# EAGLE design DigitalIO (EAGLE 7.7.0)
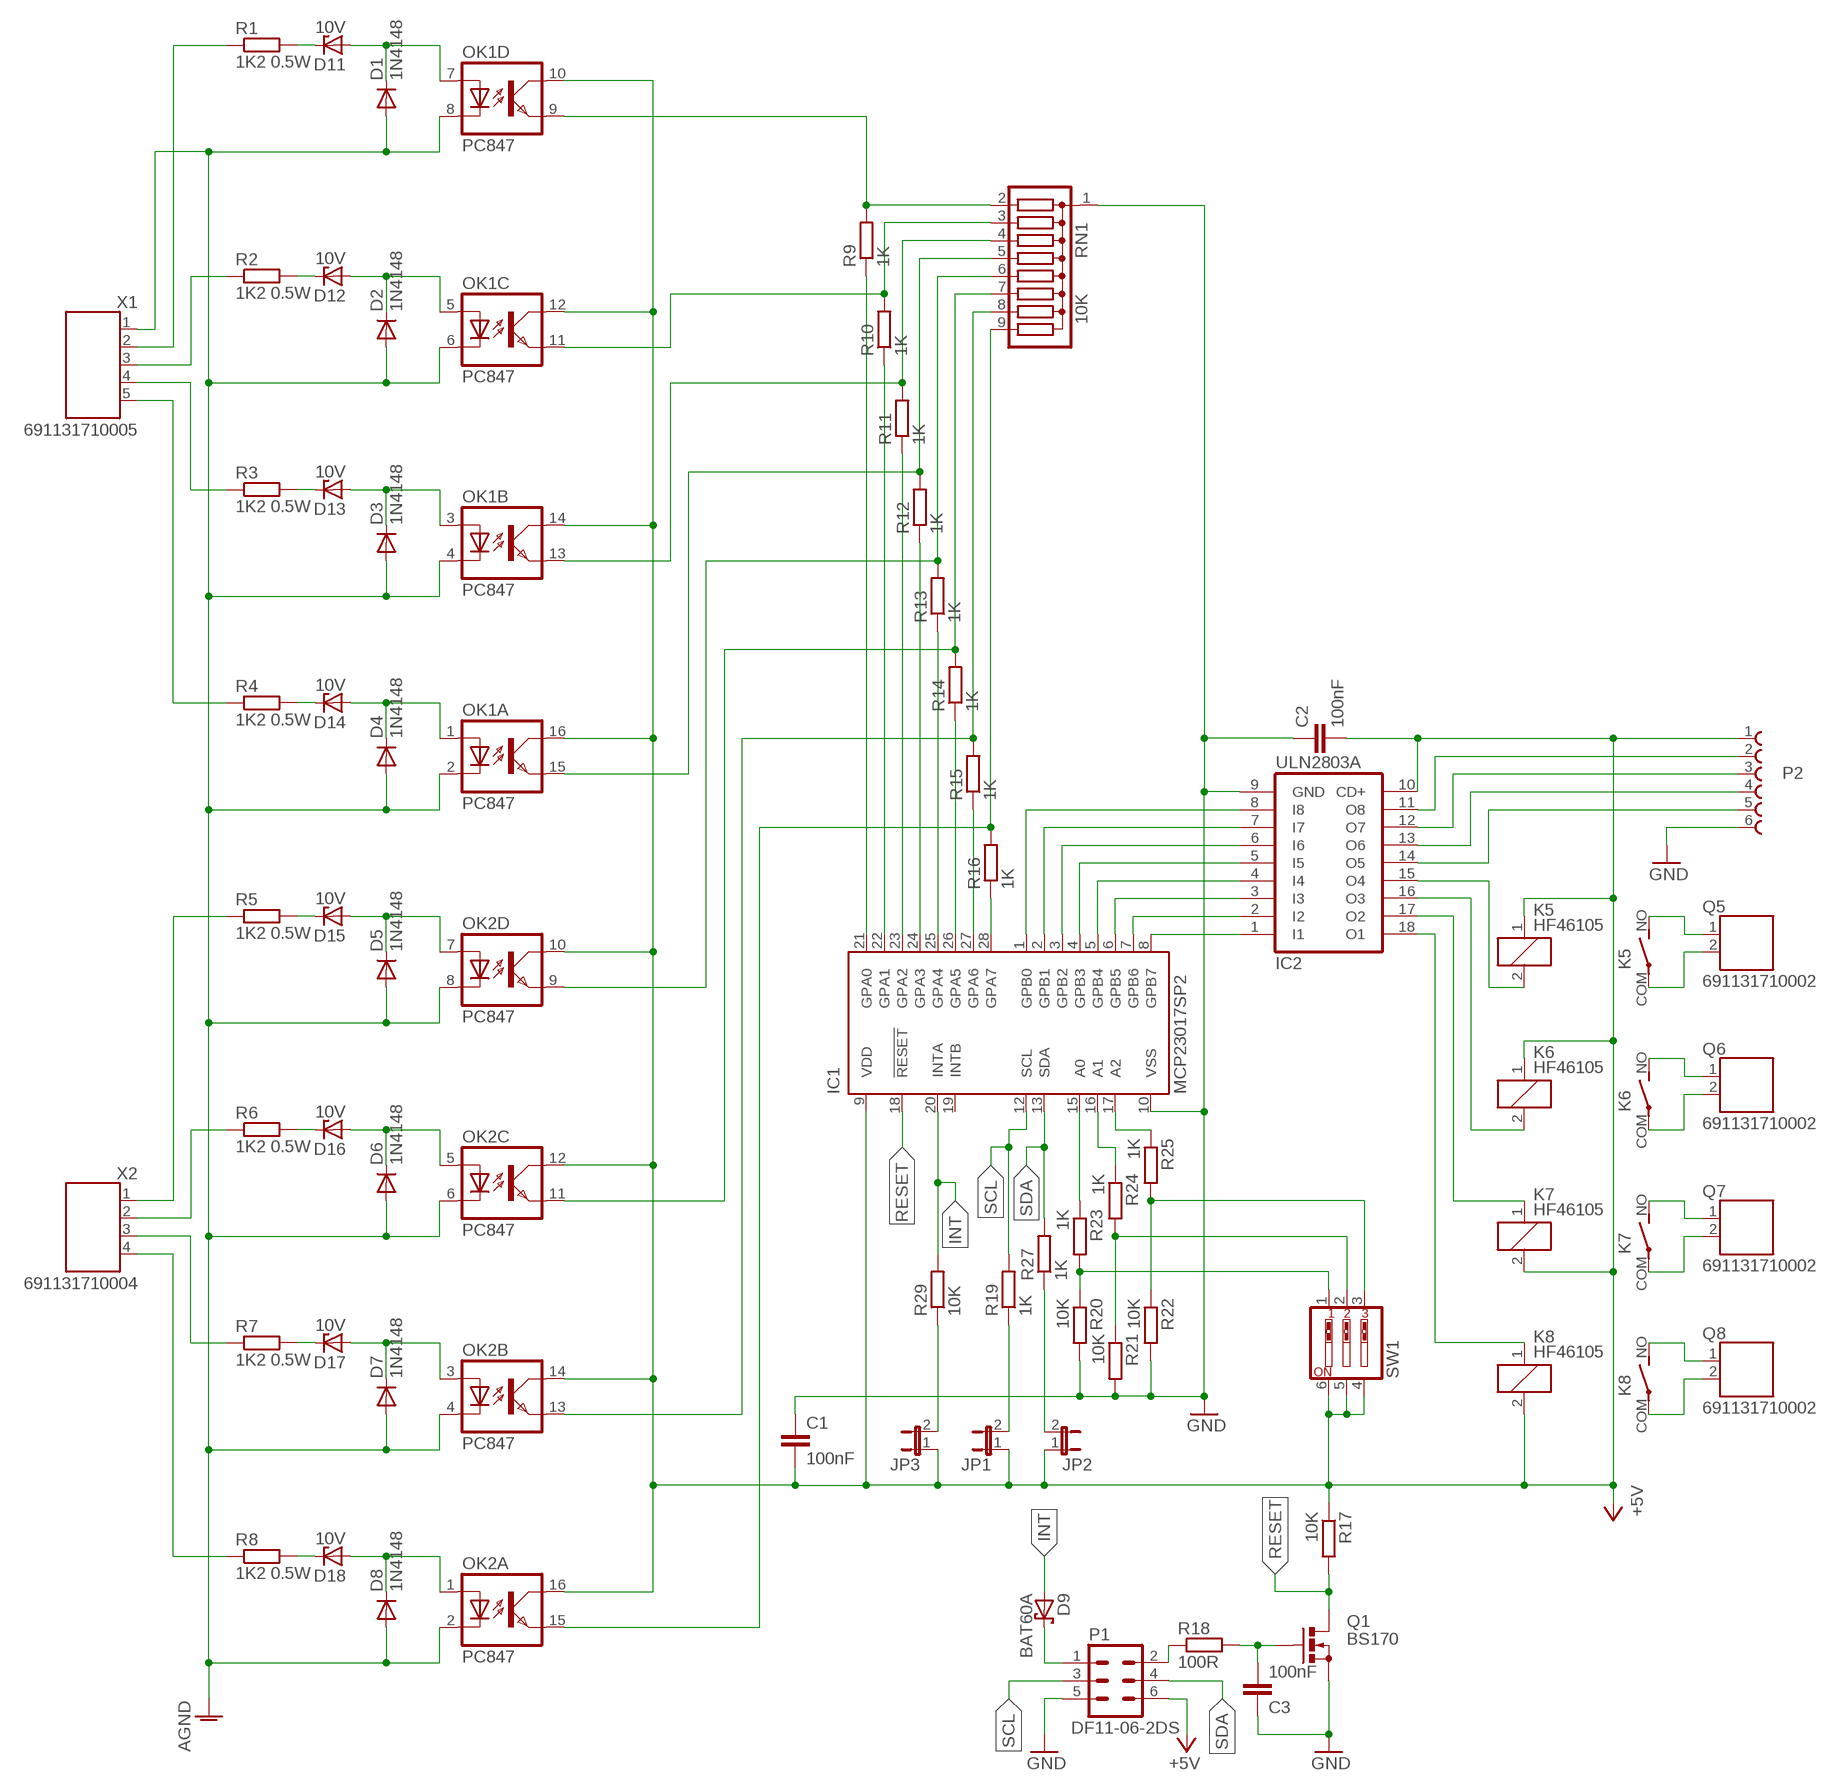
[diagram p0: schematic, sheet 1]

## Parts
C1  100nF  C-EUC0805  [C0805]
C2  100nF  C-EUC0805  [C0805]
C3  100nF  C-EUC0805  [C0805]
D1  1N4148  1N4148DO35-2V  [DO35-2V]
D2  1N4148  1N4148DO35-2V  [DO35-2V]
D3  1N4148  1N4148DO35-2V  [DO35-2V]
D4  1N4148  1N4148DO35-2V  [DO35-2V]
D5  1N4148  1N4148DO35-2V  [DO35-2V]
D6  1N4148  1N4148DO35-2V  [DO35-2V]
D7  1N4148  1N4148DO35-2V  [DO35-2V]
D8  1N4148  1N4148DO35-2V  [DO35-2V]
D9  BAT60A  BAT60J  [SOD323_ST]
D11  10V  ZENER-DIODEZD-2.5  [ZDIO-2.5]
D12  10V  ZENER-DIODEZD-2.5  [ZDIO-2.5]
D13  10V  ZENER-DIODEZD-2.5  [ZDIO-2.5]
D14  10V  ZENER-DIODEZD-2.5  [ZDIO-2.5]
D15  10V  ZENER-DIODEZD-2.5  [ZDIO-2.5]
D16  10V  ZENER-DIODEZD-2.5  [ZDIO-2.5]
D17  10V  ZENER-DIODEZD-2.5  [ZDIO-2.5]
D18  10V  ZENER-DIODEZD-2.5  [ZDIO-2.5]
IC1  MCP23017SP2  [DIL28-3-ROUND]
IC2  ULN2803A  ULN2803ASP2  [DIL18-ROUND]
JP1  JP1E  [JP1]
JP2  JP1E  [JP1]
JP3  JP1E  [JP1]
K5  HF46105  [HF46]
K6  HF46105  [HF46]
K7  HF46105  [HF46]
K8  HF46105  [HF46]
OK1  PC847  [DIL16]
OK2  PC847  [DIL16]
P1  DF11-06-2DS  [DF11-06DP-2DS]
P2  62000611121  [62000611121]
Q1  BS170  [SOT54E]
Q5  691131710002  [691131710002]
Q6  691131710002  [691131710002]
Q7  691131710002  [691131710002]
Q8  691131710002  [691131710002]
R1  1K2 0.5W  R-EU_0207/2V  [0207/2V]
R2  1K2 0.5W  R-EU_0207/2V  [0207/2V]
R3  1K2 0.5W  R-EU_0207/2V  [0207/2V]
R4  1K2 0.5W  R-EU_0207/2V  [0207/2V]
R5  1K2 0.5W  R-EU_0207/2V  [0207/2V]
R6  1K2 0.5W  R-EU_0207/2V  [0207/2V]
R7  1K2 0.5W  R-EU_0207/2V  [0207/2V]
R8  1K2 0.5W  R-EU_0207/2V  [0207/2V]
R9  1K  R-EU_0204/2V  [0204V]
R10  1K  R-EU_0204/2V  [0204V]
R11  1K  R-EU_0204/2V  [0204V]
R12  1K  R-EU_0204/2V  [0204V]
R13  1K  R-EU_0204/2V  [0204V]
R14  1K  R-EU_0204/2V  [0204V]
R15  1K  R-EU_0204/2V  [0204V]
R16  1K  R-EU_0204/2V  [0204V]
R17  10K  R-EU_0204/2V  [0204V]
R18  100R  R-EU_0204/2V  [0204V]
R19  1K  R-EU_0204/2V  [0204V]
R20  10K  R-EU_0204/2V  [0204V]
R21  10K  R-EU_0204/2V  [0204V]
R22  10K  R-EU_0204/2V  [0204V]
R23  1K  R-EU_0204/2V  [0204V]
R24  1K  R-EU_0204/2V  [0204V]
R25  1K  R-EU_0204/2V  [0204V]
R27  1K  R-EU_0204/2V  [0204V]
R29  10K  R-EU_0204/2V  [0204V]
RN1  10K  G08R  [SIL9]
SW1  SW_DIP-3  [EDG-03]
X1  691131710005  [691131710005]
X2  691131710004  [691131710004]

## Nets
+5V: C1.2 C2.2 IC1.9(VDD) IC2.10(CD+) JP1.1 JP2.1 JP3.1 K5.1 K6.1 K7.2 K8.2 OK1.10(D:COL) OK1.12(C:COL) OK1.14(B:COL) OK1.16(A:COL) OK2.10(D:COL) OK2.12(C:COL) OK2.14(B:COL) OK2.16(A:COL) P1.6 P2.1 R17.1 SW1.4 SW1.5 SW1.6
AGND: D1.A D2.A D3.A D4.A D5.A D6.A D7.A D8.A OK1.2(A:C) OK1.4(B:C) OK1.6(C:C) OK1.8(D:C) OK2.2(A:C) OK2.4(B:C) OK2.6(C:C) OK2.8(D:C) X1.1
GND: C1.1 C2.1 C3.1 IC1.10(VSS) IC2.9(GND) P1.5 P2.6 Q1.S R20.2 R21.2 R22.2 RN1.1
INT: D9.A IC1.20(INTA) R29.2
N$1: IC1.8(GPB7) IC2.1(I1)
N$2: IC1.7(GPB6) IC2.2(I2)
N$3: IC1.6(GPB5) IC2.3(I3)
N$4: IC1.5(GPB4) IC2.4(I4)
N$5: IC1.4(GPB3) IC2.5(I5)
N$6: IC1.3(GPB2) IC2.6(I6)
N$7: IC1.2(GPB1) IC2.7(I7)
N$8: IC1.1(GPB0) IC2.8(I8)
N$9: D12.C R2.2
N$10: D11.C R1.2
N$11: R22.1 R25.2 SW1.3
N$12: D1.C D11.A OK1.7(D:A)
N$13: R6.1 X2.2
N$14: R2.1 X1.3
N$15: OK1.9(D:EMIT) R9.2 RN1.2
N$16: R3.1 X1.4
N$17: R7.1 X2.3
N$18: R1.1 X1.2
N$19: D2.C D12.A OK1.5(C:A)
N$20: OK1.11(C:EMIT) R10.2 RN1.3
N$21: D13.C R3.2
N$22: R4.1 X1.5
N$23: D3.C D13.A OK1.3(B:A)
N$24: R5.1 X2.1
N$25: OK1.13(B:EMIT) R11.2 RN1.4
N$26: R8.1 X2.4
N$27: D14.C R4.2
N$28: IC2.14(O5) P2.5
N$29: D4.C D14.A OK1.1(A:A)
N$30: IC2.13(O6) P2.4
N$31: OK1.15(A:EMIT) R12.2 RN1.5
N$32: IC2.12(O7) P2.3
N$33: D15.C R5.2
N$34: IC2.11(O8) P2.2
N$35: D5.C D15.A OK2.7(D:A)
N$36: JP2.2 R27.1
N$37: OK2.9(D:EMIT) R13.2 RN1.6
N$38: K8.NO(2:S) Q8.1
N$39: D16.C R6.2
N$40: K8.COM(2:P) Q8.2
N$41: D6.C D16.A OK2.5(C:A)
N$42: IC2.15(O4) K5.2
N$43: OK2.11(C:EMIT) R14.2 RN1.7
N$44: K7.NO(2:S) Q7.1
N$45: D17.C R7.2
N$46: K7.COM(2:P) Q7.2
N$47: D7.C D17.A OK2.3(B:A)
N$48: IC2.16(O3) K6.2
N$49: OK2.13(B:EMIT) R15.2 RN1.8
N$50: IC1.15(A0) R23.1
N$51: D18.C R8.2
N$52: IC1.16(A1) R24.1
N$53: D8.C D18.A OK2.1(A:A)
N$54: IC2.17(O2) K7.1
N$55: OK2.15(A:EMIT) R16.2 RN1.9
N$56: IC2.18(O1) K8.1
N$58: JP3.2 R29.1
N$59: IC1.21(GPA0) R9.1
N$60: IC1.22(GPA1) R10.1
N$61: JP1.2 R19.1
N$62: IC1.23(GPA2) R11.1
N$63: IC1.28(GPA7) R16.1
N$64: IC1.27(GPA6) R15.1
N$65: IC1.26(GPA5) R14.1
N$66: K5.NO(2:S) Q5.1
N$67: IC1.25(GPA4) R13.1
N$68: IC1.24(GPA3) R12.1
N$69: P1.2 R18.1
N$71: C3.2 Q1.G R18.2
N$75: K5.COM(2:P) Q5.2
N$77: R20.1 R23.2 SW1.1
N$78: R21.1 R24.2 SW1.2
N$79: IC1.17(A2) R25.1
N$80: D9.C P1.1
N$88: K6.NO(2:S) Q6.1
N$89: K6.COM(2:P) Q6.2
RESET: IC1.18(!RESET) Q1.D R17.2
SCL: IC1.12(SCL) P1.3 R19.2
SDA: IC1.13(SDA) P1.4 R27.2
Unconnected: IC1.19(INTB)

## Library data of the parts
C1-C3 = rcl:C-EU: CAPACITOR, European symbol; MF: MULTICOMP; MPN: MCRR50104X7RK0050; OC_FARNELL: 1216440
D1-D8 = diode:1N4148: DIODE high speed (Philips); OC_FARNELL: unknown
D9 = diode:BAT60J: Schottky barrier diode Source: www.st.com, BAT60J.pdf
D11-D18 = diode:ZENER-DIODE: Z-Diode; OC_FARNELL: unknown
IC1 = mcp:MCP23017: Input/Output Expander Source: https://www.microchip.com/en-us/product/MCP23017
IC2 = uln-udn:ULN2803A: DRIVER ARRAY; MF: STMICROELECTRONICS; MPN: ULN2803A; OC_FARNELL: 1094428
JP1-JP3 = jumper:JP1E: JUMPER
K5-K8 = hongfa:HF46?*: Slim Power Relay NAiS Source: http://www.hongfa.com/pro/pdf/HF46F_en.pdf; OC_FARNELL: unknown; OC_NEWARK: unknown
OK1 OK2 = optocoupler:PC847: SHARP OPTO COUPLER; OC_FARNELL: 9707735; OC_NEWARK: unknown
P1 = con-hirose-df11:DF11-06-2: HEADER; OC_FARNELL: unknown
P2 = Board_to_Board_Connectors_rev15d:62000611121: WR-PHD 2.00mm Pin Header, 6 Pins=>Code : Con_BTB_PHD_2.00_1_THT_62000611121 <http://katalog.we-online.de/media/images/eican/Con_BTB_PHD_2.00_1_THT_6200xx11121_pf2.jpg> Details see: http://katalog.we-online.de/en/em/620_0xx_111_21 Created 2014-06-03, Karrer Zheng 2014 (C) Würth Elektronik
Q1 = transistor-small-signal:BS170: N-CHANNEL MOS FET
Q5-Q8 = con-wuerth:691131710002: WR-TBL Terminal block - CUU5/2 CUU5/2GR - 2 Pins;=>Code : Con_TBL_Screw_PClamp_5.00_6911317100xx_691131710002 <http://katalog.we-online.de/media/images/eican/Con_TBL_Screw_PClamp_5.00_6911317100xx_pf2.jpg> Details see: http://katalog.we-online.de/em/datasheet/6911317100xx.pdf Created 11/23/2014, Karrer Zheng 2014 (C) Wurth Elektronik; OC_FARNELL: unknown
R1-R8 = resistor:R-EU_: RESISTOR, European symbol; MF: MULTICOMP; MPN: MCF 0.25W 1K2; OC_FARNELL: 9339124
R9-R18 R20-R25 = resistor:R-EU_: RESISTOR, European symbol; OC_FARNELL: unknown
R19 R27 R29 = rcl:R-EU_: RESISTOR, European symbol; OC_FARNELL: unknown
RN1 = resistor-sil:G08R: SIL RESISTOR; OC_FARNELL: unknown; OC_NEWARK: unknown
SW1 = special:SW_DIP-3: DIP SWITCH; OC_FARNELL: unknown
X1 = con-wuerth:691131710005: WR-TBL Terminal block - CUU5/5 - 5 Pins;=>Code : Con_TBL_Screw_PClamp_5.00_6911317100xx_691131710005 <http://katalog.we-online.de/media/images/eican/Con_TBL_Screw_PClamp_5.00_6911317100xx_pf2.jpg> Details see: http://katalog.we-online.de/em/datasheet/6911317100xx.pdf Created 11/3/2014, Karrer Zheng 2014 (C) Wurth Elektronik; OC_FARNELL: unknown
X2 = con-wuerth:691131710004: WR-TBL Terminal block - CUU5/4 - 4 Pins;=>Code : Con_TBL_Screw_PClamp_5.00_6911317100xx_691131710004 <http://katalog.we-online.de/media/images/eican/Con_TBL_Screw_PClamp_5.00_6911317100xx_pf2.jpg> Details see: http://katalog.we-online.de/em/datasheet/6911317100xx.pdf Created 11/3/2014, Karrer Zheng 2014 (C) Wurth Elektronik; OC_FARNELL: unknown

## Board
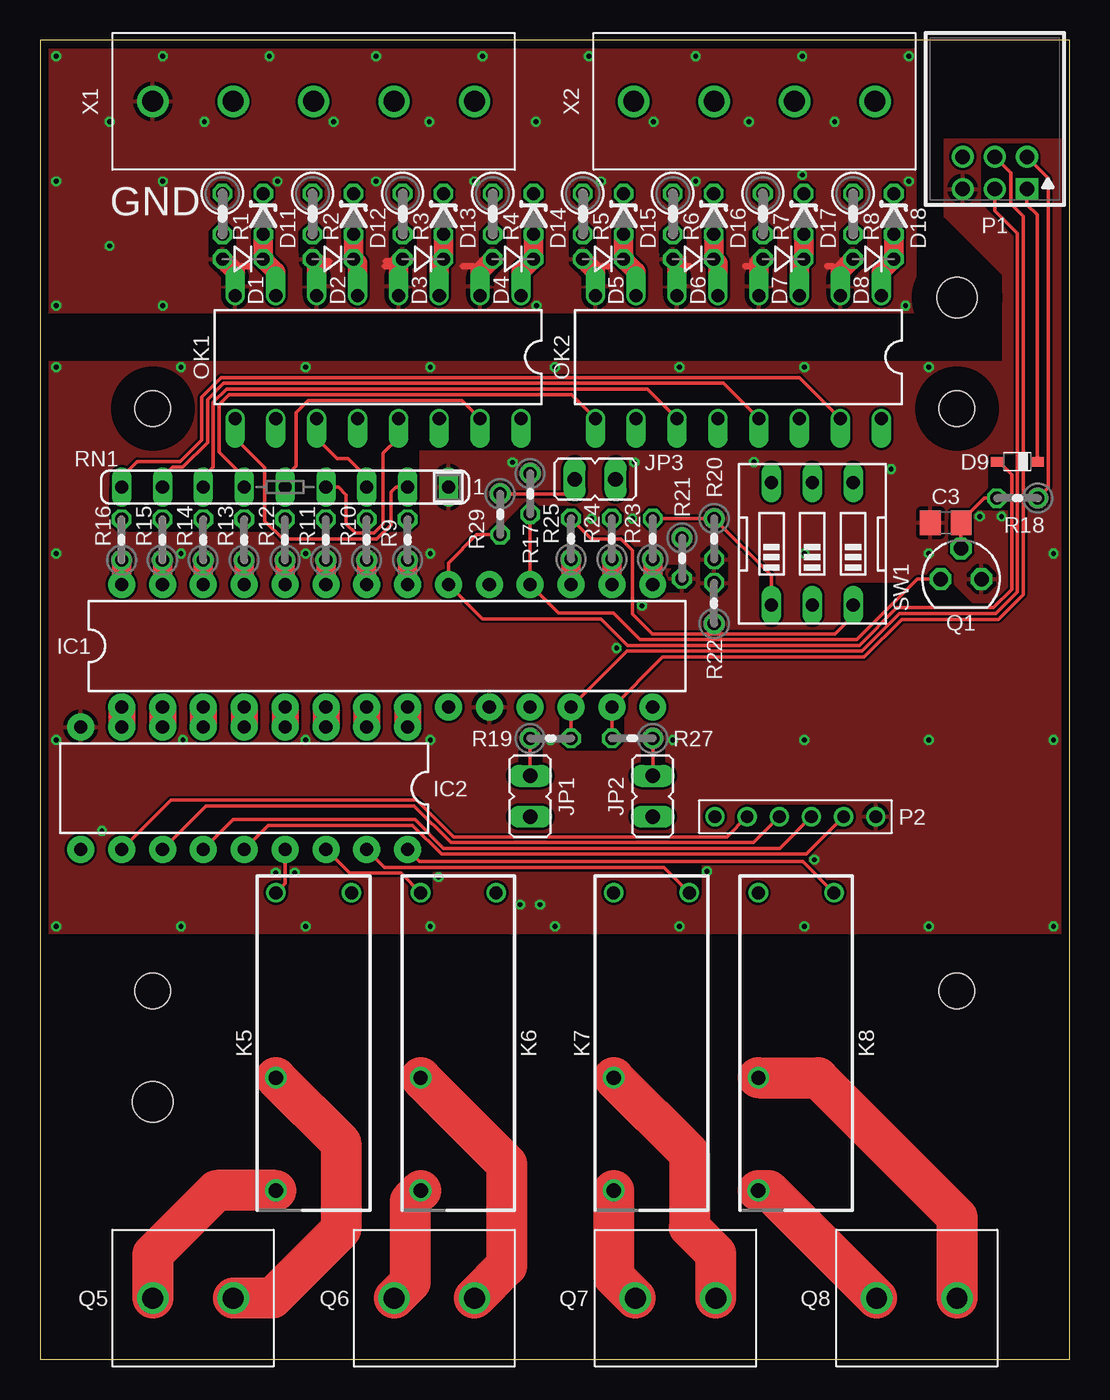
[diagram p1: board, top side]
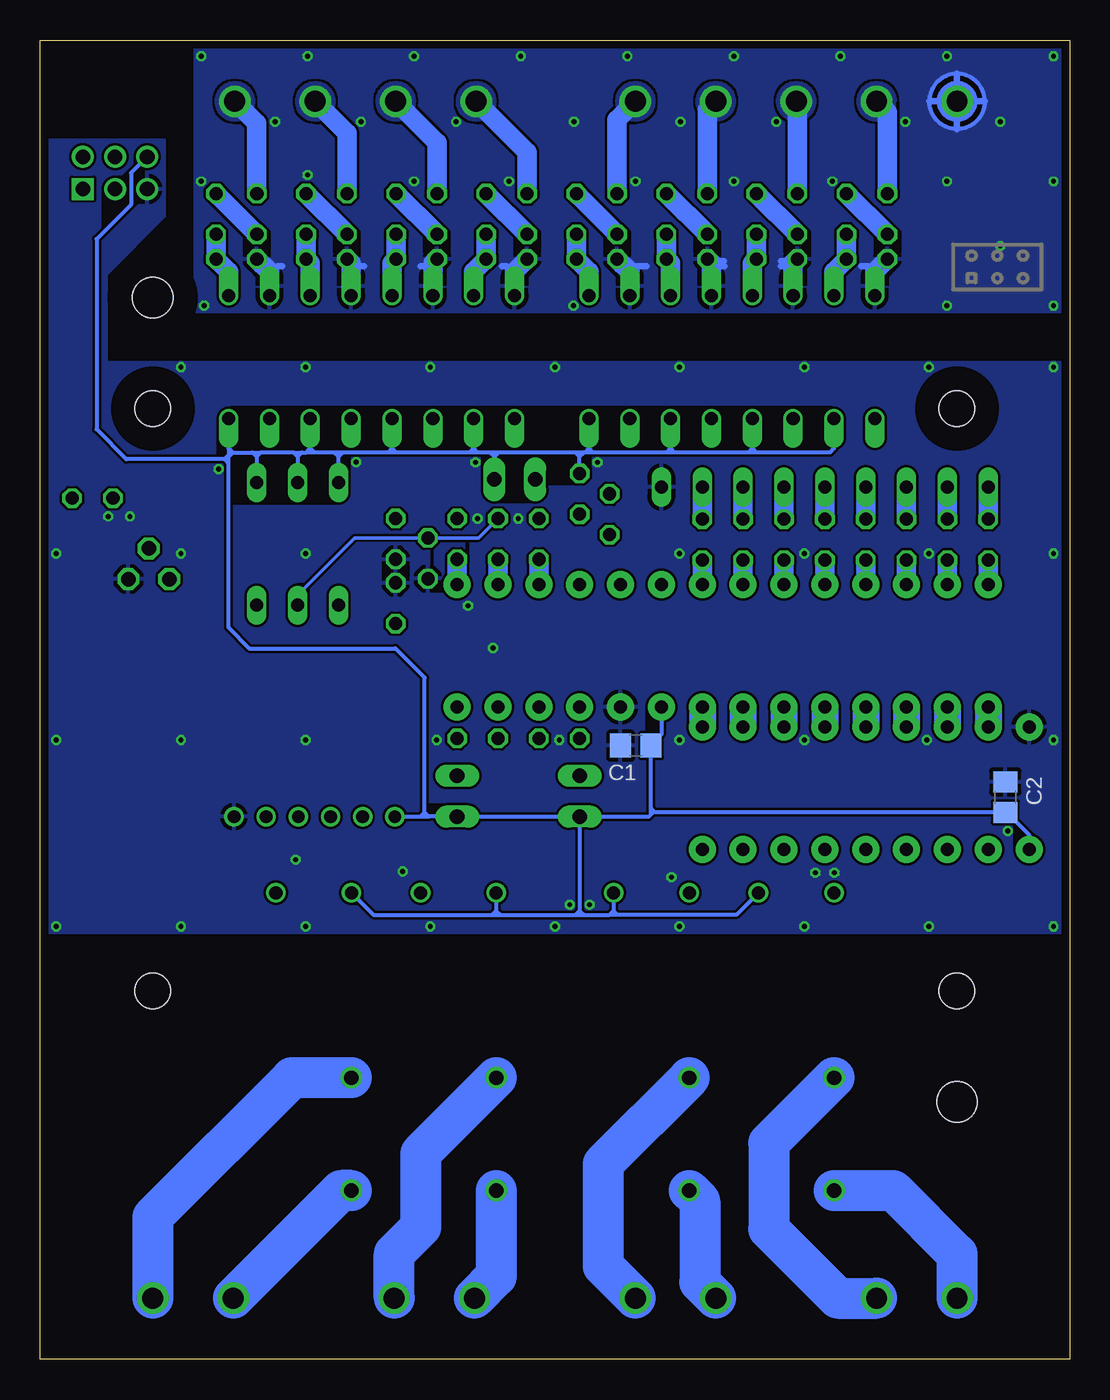
[diagram p2: board, bottom side, seen from below]

Size 64 x 82 mm. Coordinates in mm from the lower left corner, seen from the top.
Outline: 0,0 64,0 64,82 0,82 0,0
Copper layers (1*16): Top 0.035mm / dielectric 1.6mm / Bottom 0.035mm
Design rules "Elecrow *": minimum track width 6mil, minimum drill 12mil, track to track 6mil, track to pad 6mil, pad to pad 12mil, via to via 12mil, smd to smd 0mil, copper to edge 20mil, drill to drill 10mil, minimum pad ring 6mil, minimum via ring 6mil, stop-mask expansion 0mil, vias tented up to drill 100mil, thermal gap 10mil
Holes 2.5 mm at 57,66 7,16
Holes 2.2 mm at 57,59.1 57,22.9 7,22.9 7,59.1
tRestrict: area 4.4,56.5 to 9.6,61.7; area 54.4,56.5 to 59.6,61.7; area 54.4,20.3 to 59.6,25.5; area 4.4,20.3 to 9.6,25.5; area 54.2,63.2 to 59.8,68.8; area 4.2,13.2 to 9.8,18.8; area 16.3,66.8 to 17.1,67.9; area 27.5,66.8 to 28.2,67.9; area 38.7,66.8 to 39.5,67.9; area 44.8,66.8 to 45.5,67.9; area 49.9,66.8 to 50.6,67.9; area 11.2,66.8 to 12,67.9; 2 more areas; 94 lines
bRestrict: area 4.4,56.5 to 9.6,61.7; area 54.4,56.5 to 59.6,61.7; area 54.4,20.3 to 59.6,25.5; area 4.4,20.3 to 9.6,25.5; area 4.2,13.2 to 9.8,18.8; area 54.2,63.2 to 59.8,68.8; area 16.3,66.8 to 17.1,67.9; area 22.4,66.8 to 23.1,67.9; area 27.5,66.8 to 28.2,67.9; area 38.7,66.8 to 39.5,67.9; area 49.9,66.8 to 50.6,67.9; area 44.8,66.8 to 45.5,67.9; 4 more areas; 75 lines

### Footprints (pad centres in the part's own frame; a part is rotated, then mirrored left to right if it is on the bottom)
C0805 = smd 1.3 x 1.5: 1 -0.95,0; 2 0.95,0
DO35-2V = drill 0.813 octagon: A 1.27,0; C -1.27,0
SOD323_ST = smd 0.8 x 0.6: A 1.25,0; C -1.25,0
ZDIO-2.5 = drill 0.813 octagon: A 1.27,0; C -1.27,0
DIL28-3-ROUND = drill 0.813 pad 1.676: 1 -16.51,-3.81; 2 -13.97,-3.81; 3 -11.43,-3.81; 4 -8.89,-3.81; 5 -6.35,-3.81; 6 -3.81,-3.81; 7 -1.27,-3.81; 8 1.27,-3.81; 9 3.81,-3.81; 10 6.35,-3.81; 11 8.89,-3.81; 12 11.43,-3.81; 13 13.97,-3.81; 14 16.51,-3.81; 15 16.51,3.81; 16 13.97,3.81; 17 11.43,3.81; 18 8.89,3.81; 19 6.35,3.81; 20 3.81,3.81; 21 1.27,3.81; 22 -1.27,3.81; 23 -3.81,3.81; 24 -6.35,3.81; 25 -8.89,3.81; 26 -11.43,3.81; 27 -13.97,3.81; 28 -16.51,3.81
DIL18-ROUND = drill 0.813 pad 1.676: 1 -10.16,-3.81; 2 -7.62,-3.81; 3 -5.08,-3.81; 4 -2.54,-3.81; 5 0,-3.81; 6 2.54,-3.81; 7 5.08,-3.81; 8 7.62,-3.81; 9 10.16,-3.81; 10 10.16,3.81; 11 7.62,3.81; 12 5.08,3.81; 13 2.54,3.81; 14 0,3.81; 15 -2.54,3.81; 16 -5.08,3.81; 17 -7.62,3.81; 18 -10.16,3.81
JP1 = drill 0.914 long: 1 0,-1.27; 2 0,1.27
HF46 = drill 0.813: 1 -9.35,2.35; 2 -9.35,-2.35 | drill 0.889: COM 2.15,-2.35 | drill 0.9: NO 9.15,-2.35
DIL16 = drill 0.813 offset: 1 -8.89,-3.81; 2 -6.35,-3.81; 3 -3.81,-3.81; 4 -1.27,-3.81; 5 1.27,-3.81; 6 3.81,-3.81; 7 6.35,-3.81; 8 8.89,-3.81; 9 8.89,3.81; 10 6.35,3.81; 11 3.81,3.81; 12 1.27,3.81; 13 -1.27,3.81; 14 -3.81,3.81; 15 -6.35,3.81; 16 -8.89,3.81
DF11-06DP-2DS = drill 0.914 square: 1 2,-1 | drill 0.914: 2 2,1; 3 0,-1; 4 0,1; 5 -2,-1; 6 -2,1
62000611121 = drill 0.8: 1 -5,0; 2 -3,0; 3 -1,0; 4 1,0; 5 3,0; 6 5,0
SOT54E = drill 0.9 octagon: D -1.27,0; G 0,1.905; S 1.27,0
691131710002 = drill 1.3: 1 -2.5,0; 2 2.5,0
0207/2V = drill 0.813 octagon: 1 -1.27,0; 2 1.27,0
0204V = drill 0.813 octagon: 1 -1.27,0; 2 1.27,0
SIL9 = drill 0.813 long: 1 -10.16,0; 2 -7.62,0; 3 -5.08,0; 4 -2.54,0; 5 0,0; 6 2.54,0; 7 5.08,0; 8 7.62,0; 9 10.16,0
EDG-03 = drill 0.813 long: 1 -2.54,-3.81; 2 0,-3.81; 3 2.54,-3.81; 4 2.54,3.81; 5 0,3.81; 6 -2.54,3.81
691131710005 = drill 1.3: 1 -10,0; 2 -5,0; 3 0,0; 4 5,0; 5 10,0
691131710004 = drill 1.3: 1 -7.5,0; 2 -2.5,0; 3 2.5,0; 4 7.5,0

### Placement (x,y rotation side)
C1  26.97,38.15 0 bottom
C2  4,34.95 270 bottom
C3  56.3,52 0 top
D1  12.6,68.4 180 top
D2  18.2,68.4 180 top
D3  23.8,68.4 180 top
D4  29.4,68.4 180 top
D5  35,68.4 180 top
D6  40.6,68.4 180 top
D7  46.2,68.4 180 top
D8  51.8,68.4 180 top
D9  60.75,55.8 180 top
D11  13.87,71.2 270 top
D12  19.47,71.2 270 top
D13  25.07,71.2 270 top
D14  30.67,71.2 270 top
D15  36.27,71.2 270 top
D16  41.87,71.2 270 top
D17  47.47,71.2 270 top
D18  53.07,71.2 270 top
IC1  21.57,44.35 0 top
IC2  12.68,35.5 180 top
JP1  30.46,35 0 top
JP2  38.08,35 0 top
JP3  34.5,54.71 90 top
K5  17,19.65 270 top
K6  26,19.65 270 top
K7  38,19.65 270 top
K8  47,19.65 270 top
OK1  21,62.3 180 top
OK2  43.4,62.3 180 top
P1  59.35,73.75 0 top
P2  46.95,33.73 0 top
Q1  57.25,48.5 0 top
Q5  9.5,3.8 0 top
Q6  24.5,3.8 0 top
Q7  39.5,3.8 0 top
Q8  54.5,3.8 0 top
R1  11.33,71.2 270 top
R2  16.93,71.2 270 top
R3  22.53,71.2 270 top
R4  28.13,71.2 270 top
R5  33.73,71.2 270 top
R6  39.33,71.2 270 top
R7  44.93,71.2 270 top
R8  50.53,71.2 270 top
R9  22.84,50.95 90 top
R10  20.3,50.95 90 top
R11  17.76,50.95 90 top
R12  15.22,50.95 90 top
R13  12.68,50.95 90 top
R14  10.14,50.95 90 top
R15  7.6,50.95 90 top
R16  5.06,50.95 90 top
R17  30.46,53.8 270 top
R18  60.75,53.53 180 top
R19  31.73,38.6 0 top
R20  41.9,51 270 top
R21  39.9,49.79 270 top
R22  41.9,47 90 top
R23  38.08,51 90 top
R24  35.54,51 90 top
R25  33,51 90 top
R27  36.81,38.6 180 top
R29  28.6,52.53 270 top
RN1  15.22,54.22 180 top
SW1  48,50.69 0 top
X1  17,78.2 0 top
X2  44.4,78.2 0 top

### Tracks (layer width: path | path; a pad name or v marks a point on that pad's centre or on a via)
+5V
  Bottom 0.254: IC1.9 25.38,38.85 26.02,38.21 C1.2 26.02,34.25 | P1.6 58.35,73.75 58.35,71.79 60.5,69.64 60.5,57.81 58.64,55.95 52.54,55.95 | 40.1,33.98 40.1,42.38 41.92,44.2 51,44.2 52.29,45.49 52.29,55.7 | 52.29,55.7 52.29,56.13 | 52.29,56.13 52.29,56.2 | IC2.10 2.52,32.61 3.91,34 C2.2 25.9,34 26.02,33.88 | JP1.1 JP2.1 39.85,33.73 | 39.85,33.73 40.1,33.98 | P2.1 40.35,33.73 | 40.35,33.73 40.1,33.98 | 40.35,33.73 39.85,33.73 | 52.54,55.95 52.29,55.7 | 52.04,56.38 52.29,56.13 | 48.25,56.38 48,56.13 | 48.25,56.38 50.29,56.38 | 50.29,56.38 50.54,56.13 | 50.79,56.38 50.54,56.13 | 50.54,56.13 SW1.4 | 50.79,56.38 50.29,56.38 | 47.75,56.38 48,56.13 | 48,56.13 SW1.5 | 48.25,56.38 47.75,56.38 | 25.77,34 26.02,34.25 | JP1.1 26.17,33.73 26.02,33.88 | 26.02,33.88 26.02,34.25 | 47.21,56.63 46.96,56.38 45.71,56.38 45.46,56.13 | 47.21,56.63 OK2.14 | 47.75,56.38 47.46,56.38 | 47.46,56.38 47.21,56.63 | SW1.6 45.46,56.13 | 45.46,56.13 45.21,56.38 | 42.13,56.63 42.38,56.38 | 42.38,56.38 47.46,56.38 | OK2.12 42.13,56.63 | 42.13,56.63 41.88,56.38 | OK2.10 37.05,56.63 | 37.05,56.63 37.3,56.38 | 37.3,56.38 42.38,56.38 | 37.05,56.63 36.8,56.38 36.02,56.38 35.77,56.13 | JP3.1 35.77,56.13 | 35.77,56.13 35.52,56.38 | 30.46,56.13 30.71,56.38 | 30.71,56.38 37.3,56.38 | OK1.16 29.89,56.63 | 29.89,56.63 30.14,56.38 | 30.14,56.38 30.71,56.38 | R17.1 30.46,56.13 | 30.46,56.13 30.21,56.38 | 29.64,56.38 29.89,56.63 | 24.81,56.63 25.06,56.38 | 25.06,56.38 30.14,56.38 | 19.73,56.63 19.98,56.38 | 19.98,56.38 24.56,56.38 | 24.56,56.38 25.06,56.38 | OK1.14 24.81,56.63 | 24.81,56.63 24.56,56.38 | OK1.10 14.65,56.63 14.9,56.38 19.48,56.38 | 19.48,56.38 19.98,56.38 | OK1.12 19.73,56.63 | 19.73,56.63 19.48,56.38
  Bottom 0.254: 30.46,27.88 30.21,27.63 | 30.21,27.63 28.6,27.63 | 28.6,27.63 28.35,27.88 | 28.1,27.63 28.6,27.63 | K6.1 28.35,27.88 | 28.35,27.88 28.1,27.63 | 35.65,27.88 35.4,27.63 | 35.4,27.63 30.71,27.63 | 30.71,27.63 30.21,27.63 | JP1.1 30.46,27.88 | 30.46,27.88 30.71,27.63 | 35.9,27.63 35.4,27.63 | K7.2 35.65,27.88 | 35.65,27.88 35.9,27.63 | 52.29,56.63 52.04,56.38 | 52.04,56.38 50.79,56.38 | OK2.16 52.29,56.2 | 52.29,56.2 52.54,55.95 | K5.1 20.72,27.63 28.1,27.63 | K8.2 43.28,27.63 35.9,27.63
AGND  (via drill 0.3)
  Top 0.406: 48.95,67.94 49.25,67.94 | 43.85,67.94 44.15,67.94 | 40.05,67.94 40.35,67.94 | 35,67.94 35.3,67.94 | 26.3,67.94 26.9,67.94 | 21.45,67.94 21.75,67.94 | 17.65,67.94 17.95,67.94 | 12.55,67.94 12.95,67.94 | 17.65,68.26 17.95,68.26 | 21.5,68.26 21.8,68.26
  Top 1.219: D2.A 17.19,68.14 OK1.6 | D3.A 22.27,68.14 OK1.4 | OK1.2 27.35,67.62 D4.A | OK2.8 34.51,67.62 D5.A | D6.A 39.59,68.14 OK2.6 | D7.A 44.67,68.14 OK2.4 | D8.A 49.75,67.62 OK2.2 | OK1.8 12.11,67.62 D1.A
  Bottom 0.254: 5.28,78.2 arc-90 7,79.92 arc-90 8.72,78.2 arc-90 7,76.48 arc-90 5.28,78.2
  Bottom 0.406: 43.85,67.94 44.15,67.94 | 40.05,67.94 40.35,67.94 | 35,67.94 35.3,67.94 | 26.3,67.94 26.9,67.94 | 21.45,67.94 21.75,67.94 | 17.65,67.94 17.95,67.94 | 12.55,67.94 12.95,67.94 | 48.95,67.94 49.25,67.94 | 17.65,68.26 17.95,68.26 | 21.5,68.26 21.8,68.26 | 5.28,78.2 8.72,78.2 | 7,79.92 7,76.48
  Bottom 0.54: 6,78.2 arc-180 8,78.2 arc-180 6,78.2
  Bottom 1.219: OK1.8 12.11,67.62 D1.A | D2.A 17.19,68.14 OK1.6 | D3.A 22.27,68.14 OK1.4 | OK1.2 27.35,67.62 D4.A | OK2.8 34.51,67.62 D5.A | D6.A 39.59,68.14 OK2.6 | D7.A 44.67,68.14 OK2.4 | D8.A 49.75,67.62 OK2.2
  other vias: 1,81 1,73.22 1,65.5 7.62,81 10.21,76.93 7.62,73.22 7.62,65.5 14.25,81 30.81,76.93 18.24,76.93 20.88,81 24.19,76.93 20.88,73.22 27.5,81 14.75,73.22 27,73.22 34.12,81 34.85,73.22 30.85,65.5 40.75,81 40.75,73.22 47.38,81 47.38,73.62 54,81 54,73.22 4.31,76.93 4.31,69.21 53.8,65.5 38.14,76.93 44.06,76.93 49.39,76.93
  pour Bottom (rank 2): 0,82 0,65.1 54.4,65.1 54.4,82
  pour Top (rank 2): 0,82 0,65.1 54.4,65.1 54.4,82
GND  (via drill 0.3)
  other vias: 1,26.9 8.75,26.9 16.5,26.9 24.25,26.9 32,26.9 39.75,26.9 47.5,26.9 55.25,26.9 63,26.9 1,38.49 8.87,38.49 16.49,38.49 24.25,38.49 31.73,38.49 39.35,38.49 47.5,38.49 55.25,38.49 63,38.49 1,50.08 8.75,50.08 16.5,50.08 24.25,50.08 47.5,50.08 55.25,50.08 63,50.08 1,61.67 8.75,61.67 16.5,61.67 24.25,61.67 32,61.67 39.75,61.67 47.5,61.67 55.25,61.67 31.08,28.26 29.84,28.26 48.13,31.06 35.84,44.22 37.41,46.84 3.84,32.84 58.42,52.4 59.77,52.4 34.28,52.27 44.37,55.77 52.9,55.33 36.94,55.76 29.36,55.76 36.81,52.27 14.63,30.25 15.81,30.25 24.76,29.97 41.46,30.33
  pour Bottom (rank 2): 0,62 64,62 64,26.5 0,26.5
  pour Bottom (rank 2): 56.25,75.83 64,75.83 64,62 59.88,62 59.88,67.4 56.25,71.03
  pour Top (rank 2): 0,62 64,62 64,26.5 0,26.5
  pour Top (rank 2): 56.25,75.83 64,75.83 64,62 59.88,62 59.88,67.4 56.25,71.03
INT
  Top 0.203: D9.A 59.6,55.8 60.39,55.01 60.39,47.86 59.25,46.72 53.26,46.72 50.92,44.38 36.52,44.38 34.87,46.03 27.51,46.03 IC1.20 25.38,49.5 27.14,51.26 R29.2
N$1
  Top 1.676: IC1.8 IC2.1
  Bottom 1.676: IC1.8 IC2.1
N$2
  Top 1.676: IC1.7 IC2.2
  Bottom 1.676: IC1.7 IC2.2
N$3
  Top 1.676: IC1.6 IC2.3
  Bottom 1.676: IC1.6 IC2.3
N$4
  Top 1.676: IC1.5 IC2.4
  Bottom 1.676: IC1.5 IC2.4
N$5
  Top 1.676: IC1.4 IC2.5
  Bottom 1.676: IC1.4 IC2.5
N$6
  Top 1.676: IC1.3 IC2.6
  Bottom 1.676: IC1.3 IC2.6
N$7
  Top 1.676: IC1.2 IC2.7
  Bottom 1.676: IC1.2 IC2.7
N$8
  Top 1.676: IC1.1 IC2.8
  Bottom 1.676: IC1.1 IC2.8
N$9
  Bottom 1.219: R2.2 D12.C
N$10
  Bottom 1.219: R1.2 D11.C
N$11
  Top 0.203: R25.2 34.27,51 36.1,51 36.83,50.27 36.83,46.34 38.06,45.1 41.9,45.1 | 41.9,45.1 49.39,45.1 50.54,46.25 SW1.3 | R22.1 41.9,45.1
N$12
  Top 1.219: D11.A D1.C 14.65,67.62 OK1.7
  Bottom 1.219: D11.A D1.C 14.65,67.62 OK1.7
N$13
  Bottom 1.219: R6.1 39.33,75.63 X2.2
  pour Bottom (no thermals): 40.71,78.2 arc180 43.09,78.2 arc180
N$14
  Bottom 1.219: R2.1 16.93,78.13 X1.3
  pour Bottom (no thermals): 15.81,78.2 arc180 18.19,78.2 arc180
N$15
  Top 0.203: RN1.2 22.11,54.22 21.8,53.91 21.8,51.87 20.92,50.99 15.09,50.99 13.96,52.12 13.96,55.42 12.11,57.27 OK1.9
  Bottom 1.22: RN1.2 R9.2
N$16
  Bottom 1.219: R3.1 22.53,77.67 X1.4
  pour Bottom (no thermals): 20.81,78.2 arc180 23.19,78.2 arc180
N$17
  Bottom 1.219: R7.1 44.93,76.23 X2.3
  pour Bottom (no thermals): 45.71,78.2 arc180 48.09,78.2 arc180
N$18
  Bottom 1.219: R1.1 11.33,77.53 X1.2
  pour Bottom (no thermals): 10.81,78.2 arc180 13.19,78.2 arc180
N$19
  Top 1.219: D12.A D2.C 19.73,68.14 OK1.5
  Bottom 1.219: D12.A D2.C 19.73,68.14 OK1.5
N$20
  Top 0.203: RN1.3 20.3,54.83 19.13,56 18.46,56 17.19,57.27 OK1.11
  Bottom 0.254: R10.2
  Bottom 1.22: RN1.3 R10.2
N$21
  Bottom 1.219: R3.2 D13.C
N$22
  Bottom 1.219: R4.1 28.13,77.07 X1.5
  pour Bottom (no thermals): 25.81,78.2 arc180 28.19,78.2 arc180
N$23
  Top 1.219: D13.A D3.C 24.81,68.14 OK1.3
  Bottom 1.219: D13.A D3.C 24.81,68.14 OK1.3
N$24
  Bottom 1.219: R5.1 33.73,75.03 X2.1
  pour Bottom (no thermals): 35.71,78.2 arc180 38.09,78.2 arc180
N$25
  Top 0.203: RN1.4 18.54,54.22 19.03,53.73 19.03,51.93 19.61,51.35 20.77,51.35 21.33,51.91 21.33,56.34 22.27,57.28 OK1.13
  Bottom 0.254: 17.76,52.25 R11.2
  Bottom 1.22: RN1.4 17.76,52.25
N$26
  Bottom 1.219: R8.1 50.53,76.83 X2.4
  pour Bottom (no thermals): 50.71,78.2 arc180 53.09,78.2 arc180
N$27
  Bottom 1.219: R4.2 D14.C
N$28
  Top 0.203: P2.5 47.62,31.4 24.94,31.4 23.15,33.19 14.18,33.19 IC2.14
N$29
  Top 1.219: D14.A D4.C 29.89,67.62 OK1.1
  Bottom 1.219: D14.A D4.C 29.89,67.62 OK1.1
N$30
  Top 0.203: P2.4 45.98,31.76 25.09,31.76 23.3,33.55 12,33.55 IC2.13
N$31
  Top 0.203: RN1.5 15.22,54.83 15.92,55.52 15.92,58.86 16.66,59.6 26.24,59.6 OK1.15
  Bottom 0.203: R12.2 15.22,52.25
  Bottom 1.22: 15.22,52.25 RN1.5
N$32
  Top 0.203: P2.3 44.34,32.12 25.54,32.12 23.25,34.41 10.32,34.41 IC2.12
N$33
  Bottom 1.219: R5.2 D15.C
N$34
  Top 0.203: P2.2 42.7,32.48 25.69,32.48 23.4,34.77 8.14,34.77 IC2.11
N$35
  Top 1.219: D15.A D5.C 37.05,67.62 OK2.7
  Bottom 1.219: D15.A D5.C 37.05,67.62 OK2.7
N$36
  Top 0.203: R27.1 JP2.2
N$37
  Top 0.203: RN1.6 12.68,54.83 11.12,56.39 11.12,59.34 11.74,59.96 33.04,59.96 OK2.9
  Bottom 0.203: 12.68,52.24 R13.2
  Bottom 1.22: RN1.6 12.68,52.24
N$38
  Top 2.54: Q8.1 45.3,10.5 K8.NO
  Bottom 2.54: K8.NO 45.3,10.5 Q8.1
N$39
  Bottom 1.219: R6.2 D16.C
N$40
  Top 2.54: K8.COM 48.35,17.5 57,8.85 Q8.2
  Bottom 2.54: K8.COM 48.35,17.5 57,8.85 Q8.2
N$41
  Top 1.219: D16.A D6.C 42.13,68.14 OK2.5
  Bottom 1.219: D16.A D6.C 42.13,68.14 OK2.5
N$42
  Top 0.203: IC2.15 15.22,29.57 K5.2
N$43
  Top 0.203: RN1.7 10.14,54.83 10.76,55.45 10.76,59.5 11.58,60.32 37.76,60.32 OK2.11
  Bottom 1.22: RN1.7 R14.2
N$44
  Top 2.54: K7.NO 35.65,5.15 Q7.1
  Bottom 2.54: K7.NO 35.65,5.15 Q7.1
N$45
  Bottom 1.219: R7.2 D17.C
N$46
  Top 2.54: K7.COM 40.35,12.8 40.35,8.21 42,6.56 Q7.2
  Bottom 2.54: K7.COM 40.35,12.8 40.35,8.21 42,6.56 Q7.2
N$47
  Top 1.219: D17.A D7.C 47.21,68.14 OK2.3
  Bottom 1.219: D17.A D7.C 47.21,68.14 OK2.3
N$48
  Top 0.203: IC2.16 19.23,30.22 22.43,30.22 K6.2
N$49
  Top 0.203: RN1.8 7.6,54.83 8.22,55.45 8.86,55.45 10.4,56.99 10.4,59.67 11.41,60.68 42.48,60.68 OK2.13
  Bottom 0.254: R15.2 7.6,52.26
  Bottom 1.22: 7.6,52.26 RN1.8
N$50
  Top 1.22: R23.1 IC1.15
  Bottom 1.22: R23.1 IC1.15
N$51
  Bottom 1.219: R8.2 D18.C
N$52
  Top 1.22: R24.1 IC1.16
  Bottom 1.22: R24.1 IC1.16
N$53
  Top 1.219: D18.A D8.C 52.29,67.62 OK2.1
  Bottom 1.219: D18.A D8.C 52.29,67.62 OK2.1
N$54
  Top 0.203: IC2.17 21.41,30.58 38.77,30.58 K7.1
N$55
  Top 0.203: RN1.9 5.06,54.83 6.04,55.81 8.71,55.81 10.04,57.14 10.04,59.82 11.26,61.04 47.2,61.04 OK2.15
  Bottom 1.22: R16.2 RN1.9
N$56
  Top 0.203: K8.1 47.41,30.94 23.59,30.94 IC2.18
N$58
  Top 0.203: R29.1 32.81,53.8 33.23,54.22 JP3.2
N$59
  Top 1.22: R9.1 IC1.21
  Bottom 1.22: R9.1 IC1.21
N$60
  Top 1.22: R10.1 IC1.22
  Bottom 1.22: R10.1 IC1.22
N$61
  Top 0.203: R19.1 JP1.2
N$62
  Top 1.22: R11.1 IC1.23
  Bottom 1.22: R11.1 IC1.23
N$63
  Top 1.22: R16.1 IC1.28
  Bottom 1.22: R16.1 IC1.28
N$64
  Top 1.22: R15.1 IC1.27
  Bottom 1.22: IC1.27 R15.1
N$65
  Top 1.22: R14.1 IC1.26
  Bottom 1.22: R14.1 IC1.26
N$66
  Top 2.54: K5.NO 10.96,10.5 7,6.54 Q5.1
  Bottom 2.54: K5.NO 10.96,10.5 7,6.54 Q5.1
N$67
  Top 1.22: R13.1 IC1.25
  Bottom 1.22: R13.1 IC1.25
N$68
  Top 1.22: R12.1 IC1.24
  Bottom 1.22: R12.1 IC1.24
N$69
  Top 0.203: P1.2 62.67,73.43 62.67,54.18 R18.1
N$71
  Top 0.203: Q1.G C3.2 57.64,52.39 57.64,52.49 58.68,53.53 R18.2
N$75
  Top 2.54: K5.COM 18.7,13.45 18.7,8.08 14.42,3.8 Q5.2
  Bottom 2.54: K5.COM 18.7,13.45 18.7,8.08 14.42,3.8 Q5.2
N$77
  Top 0.203: R23.2 R20.1 45.46,48.71 SW1.1
N$78
  Bottom 0.203: R24.2 36.75,51.06 R21.1 44.45,51.06 48,47.51 SW1.2
N$79
  Top 1.22: R25.1 IC1.17
  Bottom 1.22: R25.1 IC1.17
N$80
  Top 0.203: D9.C 62,71.14 61.35,71.79 P1.1
N$88
  Top 2.54: Q6.1 23,4.8 23,9.85 K6.NO
  Bottom 2.54: Q6.1 23,4.8 23,9.85 K6.NO
N$89
  Top 2.54: K6.COM 29,12.15 29,5.8 Q6.2
  Bottom 2.54: K6.COM 29,12.15 29,5.8 Q6.2
RESET
  Top 0.203: Q1.D 54.52,48.5 50.76,44.74 37.3,44.74 35.64,46.4 32.22,46.4 IC1.18 R17.2
SCL
  Top 0.203: R19.2 IC1.12 36.48,44.02 51.07,44.02 53.41,46.36 59.41,46.36 60.75,47.7 60.75,70.01 59.35,71.41 P1.3
SDA
  Top 0.203: R27.2 IC1.13 35.54,40.5 38.7,43.66 51.22,43.66 53.56,46 59.56,46 61.11,47.55 61.11,71.07 60.35,71.83 60.35,73.75 P1.4

### Text on the board
tNames: GND
tDocu: JP1/SCL, JP2/SDA: / Pull high, if set / JP3/INT: / Set, if open drain
bDocu: 5.0V | SDA | RESET | P1 | GND | SCL | INT | 8DI/8DO / V1.1